# Altium schematic sheet Signal Control Block.SchDoc: Signal Control Block
size 292 x 193 mm; SheetNumber: 5; SheetTotal: 15
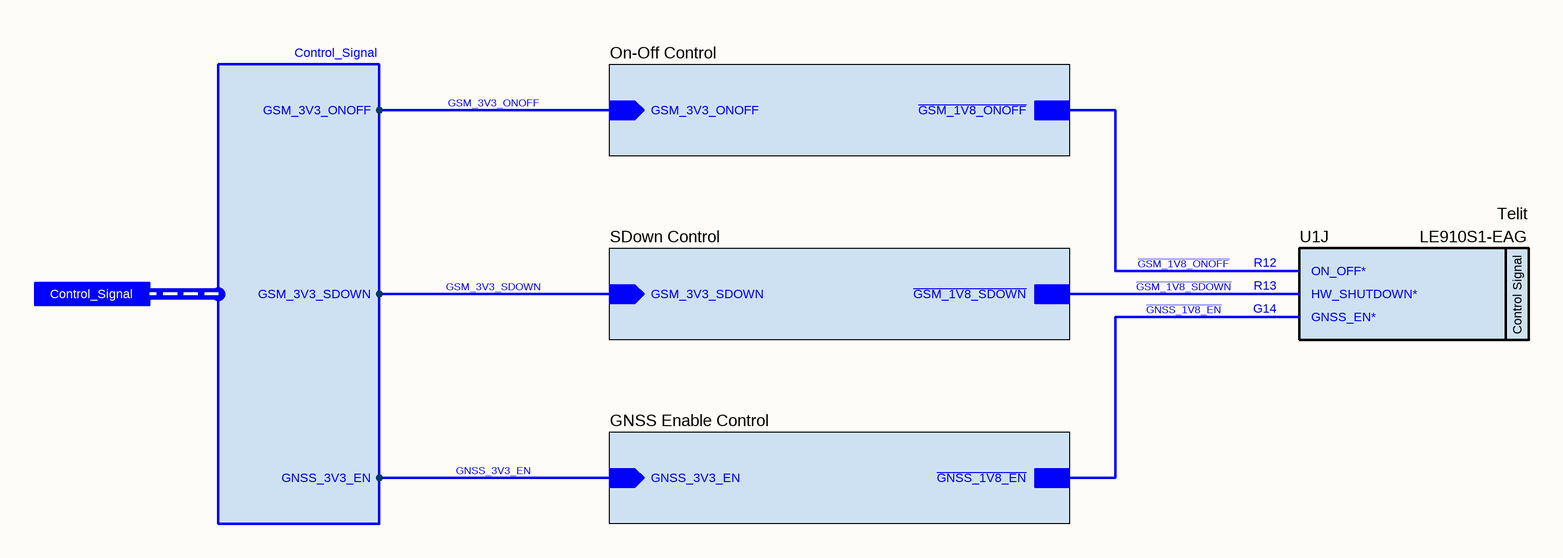
[diagram p0: Signal Control Block.SchDoc]

## Parts
U1  Manufacturer Part Number: LE910S1-EAG  Manufacturer Name: Telit  [LE910 GSM Modem]  (hidden comment: LE910S1-EAG LTE GSM Module)  (part J of 19)

## Sub-sheets
GNSS Enable Control = GNSS EN Signal Control.SchDoc: GNSS_3V3_EN (in), ~{GNSS_1V8_EN}
On-Off Control = On-Off Signal Control.SchDoc: GSM_3V3_ONOFF (in), ~{GSM_1V8_ONOFF}
SDown Control = Shut Down Signal Control.SchDoc: GSM_3V3_SDOWN (in), ~{GSM_1V8_SDOWN}

## Ports
Control_Signal (harness Control_Signal)

## Harnesses
Control_Signal: GSM_3V3_ONOFF, GSM_3V3_SDOWN, GNSS_3V3_EN

## Nets
~{GNSS_1V8_EN}: U1.G14(GNSS_EN*) ; sheet GNSS Enable Control/~{GNSS_1V8_EN}
~{GSM_1V8_ONOFF}: U1.R12(ON_OFF*) ; sheet On-Off Control/~{GSM_1V8_ONOFF}
~{GSM_1V8_SDOWN}: U1.R13(HW_SHUTDOWN*) ; sheet SDown Control/~{GSM_1V8_SDOWN}
GNSS_3V3_EN: sheet GNSS Enable Control/GNSS_3V3_EN, port Control_Signal.GNSS_3V3_EN
GSM_3V3_ONOFF: sheet On-Off Control/GSM_3V3_ONOFF, port Control_Signal.GSM_3V3_ONOFF
GSM_3V3_SDOWN: sheet SDown Control/GSM_3V3_SDOWN, port Control_Signal.GSM_3V3_SDOWN

## Notes on the sheet
- © 2021 All rights reserved.
  This document may not, in whole or in part, be copied, photocopied, reproduced, translated or converted to any electronic or machine readable from without prior written permission of Mehmet Günce Akkoyun.
  Engineer contact : akkoyun@me.com
- Property of
- Engineer :
- Date :
- Size :
- A4
- Time :
- Project :
- Page :
- /
- Customer :
- Product ID :
- Module ID :
- Version :
- File :
- Revision :
- (in symbol IC - LE910S1-EAG, part J) Control Signal

## Library data of the parts
U1 = IC - LE910S1-EAG: Telit LE910S1-EAG GPRS/GNSS Module; Case: BGA